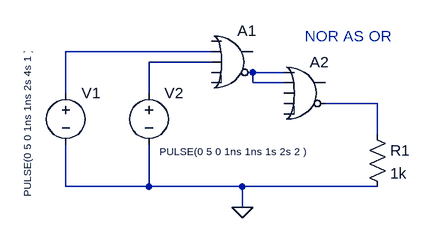
[diagram p0: schematic 208.asc]
208.asc, the LTspice schematic file:
Version 4
SHEET 1 880 680
WIRE 192 96 -32 96
WIRE 192 112 96 112
WIRE 304 128 256 128
WIRE 256 144 256 128
WIRE 304 144 256 144
WIRE -32 160 -32 96
WIRE 96 160 96 112
WIRE 448 176 368 176
WIRE 448 224 448 176
WIRE -32 304 -32 240
WIRE 96 304 96 240
WIRE 96 304 -32 304
WIRE 240 304 96 304
WIRE 448 304 240 304
WIRE 240 336 240 304
FLAG 240 336 0
SYMBOL Digital\\or 224 48 R0
SYMATTR InstName A1
SYMBOL Digital\\or 336 96 R0
SYMATTR InstName A2
SYMBOL res 432 208 R0
SYMATTR InstName R1
SYMATTR Value 1k
SYMBOL voltage -32 144 R0
WINDOW 3 -59 176 VLeft 1
SYMATTR InstName V1
SYMATTR Value PULSE(0 5 0 1ns 1ns 2s 4s 1 )
SYMBOL voltage 96 144 R0
WINDOW 3 16 106 Left 1
SYMATTR InstName V2
SYMATTR Value PULSE(0 5 0 1ns 1ns 1s 2s 2 )
TEXT 336 72 Left 2 ;NOR AS OR

The netlist it stands for:
* 208.asc
A1 0 N001 N002 0 0 N003 0 0 OR
A2 N003 N003 0 0 0 N004 0 0 OR
R1 N004 0 1k
V1 N001 0 PULSE(0 5 0 1ns 1ns 2s 4s 1 )
V2 N002 0 PULSE(0 5 0 1ns 1ns 1s 2s 2 )
* NOR AS OR
.backanno
.end